# EAGLE design reg_i2c (EAGLE 7.2.0)
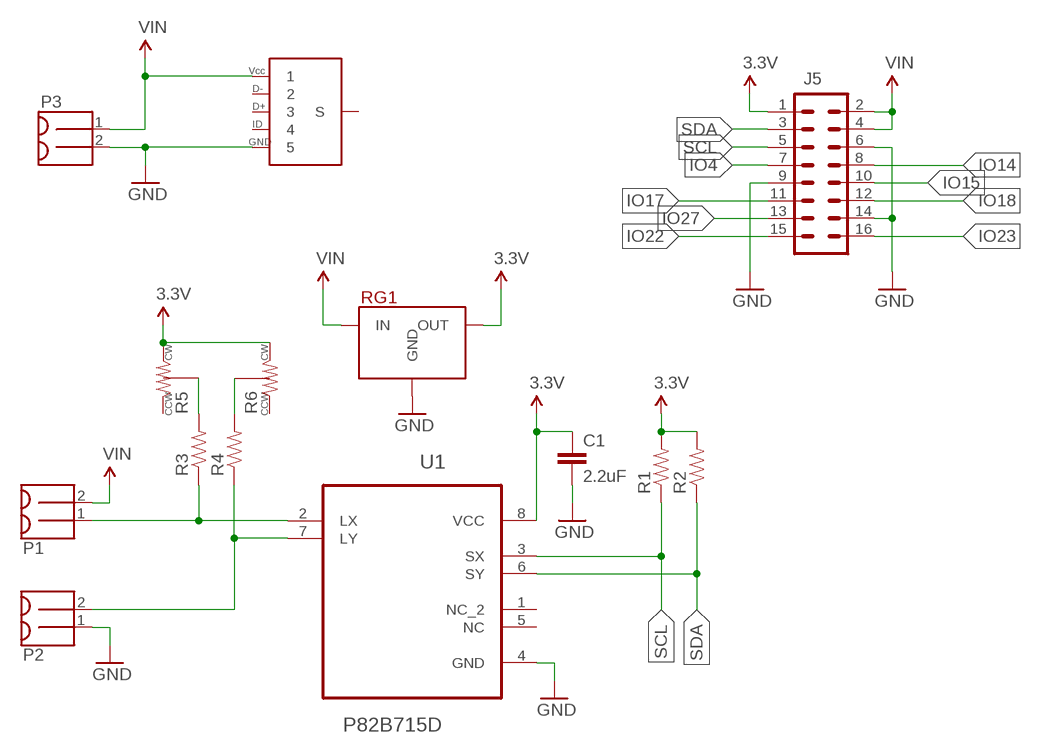
[diagram p0: schematic, sheet 1]

## Parts
C1  2.2uF  2.2UF-10V-20%(0603)  [0603-CAP]
J5  M08X2  [2X8]
P1  MOLEX_MINILITE_TRAP_2  [MOLEX_MINILITE_TRAP_2]
P2  MOLEX_MINILITE_TRAP_2  [MOLEX_MINILITE_TRAP_2]
P3  MOLEX_MINILITE_TRAP_2  [MOLEX_MINILITE_TRAP_2]
R1  RESISTOR0805-RES  [0805]
R2  RESISTOR0805-RES  [0805]
R3  RESISTOR0805-RES  [0805]
R4  RESISTOR0805-RES  [0805]
R5  POT_3MM  [POT_3MM]
R6  POT_3MM  [POT_3MM]
RG1  MURATA_REG  [MURATA_REG_HOR]
U1  P82B715D  [SOIC127P600X175-8N]
U$1  USB_MICRO  [USB_MICROB_MOLEX]

## Nets
3.3V: C1.1 J5.1 R1.2 R2.2 R5.3 R6.3 RG1.3(OUT) U1.8(VCC)
GND: C1.2 J5.6 J5.9 J5.14 P2.1 P3.2 RG1.2(GND) U1.4(GND) U$1.5
IO4: J5.7
IO14: J5.8
IO15: J5.10
IO17: J5.11
IO18: J5.12
IO22: J5.15
IO23: J5.16
IO27: J5.13
N$3: R4.2 R6.2
N$4: R3.2 R5.2
N$6: P2.2 R4.1 U1.7(LY)
N$7: P1.1 R3.1 U1.2(LX)
SCL: J5.5 R1.1 U1.3(SX)
SDA: J5.3 R2.1 U1.6(SY)
VIN: J5.2 J5.4 P1.2 P3.1 RG1.1(IN) U$1.1
Unconnected: R5.1 R6.1 U1.1(NC_2) U1.5(NC) U$1.2 U$1.3 U$1.4 U$1.S1(S) U$1.S2(S) U$1.S3(S) U$1.S4(S) U$1.S5(S) U$1.S6(S)

## Library data of the parts
C1 = SparkFun-Capacitors:2.2UF-10V-20%(0603): CAP-07888; PROD_ID: CAP-07888
J5 = SparkFun-Connectors:M08X2: .1" headers, two rows of 8 each
P1-P3 = Puffin:MOLEX_MINILITE_TRAP_2
R1-R4 = SparkFun-Resistors:RESISTOR: Resistor Basic schematic elements and footprints for 0603, 1206, and PTH resistors.
R5 R6 = Puffin:POT_3MM
RG1 = Puffin:MURATA_REG
U1 = Texas Instruments_By_element14_Batch_1:P82B715D: I2C BUS EXTENDER; MPN: P82B715D; OC_FARNELL: 1604945; OC_NEWARK: 84M9793; PACKAGE: SOIC-8; SUPPLIER: Texas Instruments
U$1 = Puffin:USB_MICRO

## Board
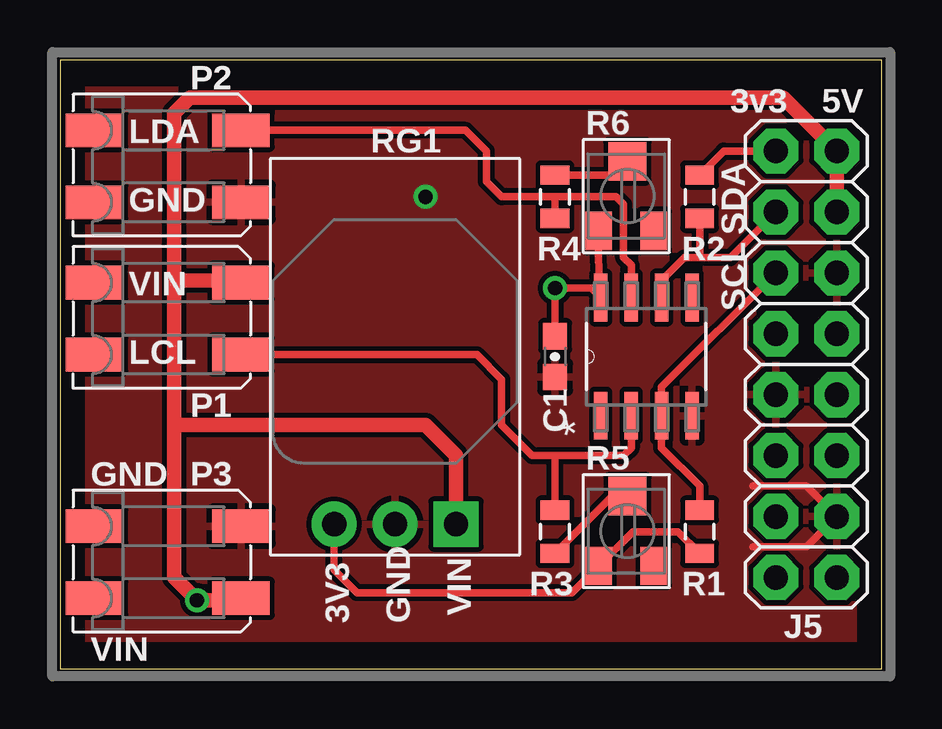
[diagram p1: board, top side]
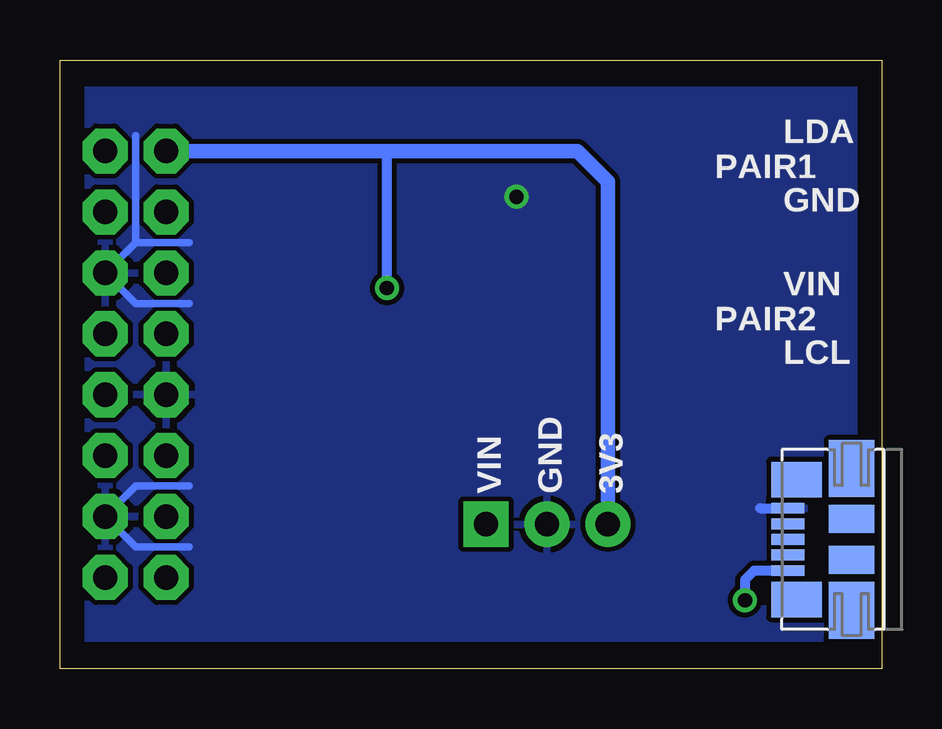
[diagram p2: board, bottom side, seen from below]

Size 34.27 x 25.39 mm. Coordinates in mm from the lower left corner, seen from the top.
Outline: 0,0 34.27,0 34.27,25.39 0,25.39 0,0
Copper layers (1*16): Top 0.035mm / dielectric 1.5mm / Bottom 0.035mm
Design rules "default": minimum track width 10mil, minimum drill 24mil, track to track 8mil, track to pad 8mil, pad to pad 8mil, via to via 8mil, smd to smd 8mil, copper to edge 40mil, drill to drill 8mil, minimum pad ring 10mil, minimum via ring 8mil, stop-mask expansion 4mil, vias tented up to drill 0mil, thermal gap 10mil

### Footprints (pad centres in the part's own frame; a part is rotated, then mirrored left to right if it is on the bottom)
0603-CAP = smd 1.1 x 1: 1 -0.85,0; 2 0.85,0
2X8 = drill 1.016 pad 1.88 octagon: 1 0,0; 2 0,2.54; 3 2.54,0; 4 2.54,2.54; 5 5.08,0; 6 5.08,2.54; 7 7.62,0; 8 7.62,2.54; 9 10.16,0; 10 10.16,2.54; 11 12.7,0; 12 12.7,2.54; 13 15.24,0; 14 15.24,2.54; 15 17.78,0; 16 17.78,2.54
MOLEX_MINILITE_TRAP_2 = smd 2.4 x 1.4: 1 -3.1,1.5; 2 -3.1,-1.5; 3 3,1.5; 4 3,-1.5
0805 = smd 0.8 x 1.2: 1 -0.9,0; 2 0.9,0
POT_3MM = smd 1.1 x 1.6: 1 2.85,0.8; 3 0.55,0.8 | smd 1.6 x 1.6: 2 1.75,3.7
MURATA_REG_HOR = drill 1.016 pad 1.88 square: 1 2.54,0 | drill 1.016 pad 1.88: 2 0,0; 3 -2.54,0
SOIC127P600X175-8N = smd 1.981 x 0.559: 1 -2.464,1.905; 2 -2.464,0.635; 3 -2.464,-0.635; 4 -2.464,-1.905; 5 2.464,-1.905; 6 2.464,-0.635; 7 2.464,0.635; 8 2.464,1.905
USB_MICROB_MOLEX = smd 1.38 x 0.45: 1 2.65,1.3; 2 2.65,0.65; 3 2.65,0; 4 2.65,-0.65; 5 2.65,-1.3 | smd 2.1 x 1.48: S1 2.3,-2.5; S2 2.3,2.5 | smd 1.9 x 2.375: S3 0,2.95; S4 0,-2.95 | smd 1.9 x 1.175: S5 0,0.85; S6 0,-0.85

### Placement (x,y rotation side)
C1  20.64,13.02 270 top
J5  29.84,21.59 270 top
P1  4.45,14.61 180 top
P2  4.45,20.95 180 top
P3  4.45,4.45 180 top
R1  26.67,5.71 270 top
R2  26.67,19.68 90 top
R3  20.64,5.71 270 top
R4  20.64,19.68 90 top
R5  21.91,3.49 0 top
R6  21.91,17.46 0 top
RG1  13.97,6.03 0 top
U1  24.45,13.02 90 top
U$1  1.27,5.4 180 bottom

### Tracks (layer width: path | path; a pad name or v marks a point on that pad's centre or on a via)
3.3V  (via drill 0.6)
  Top 0.305: C1.1 v20.64,15.88 22.15,15.88 U1.8 22.47,15.56 R6.3 | R1.2 25.77,5.71 23.88,5.71 R5.3 21.34,3.17 12.38,3.17 11.43,4.13 RG1.3 | R2.2 27.68,21.59 J5.1
  Bottom 0.406: v20.64,15.88 20.64,21.59
  Bottom 0.61: J5.1 20.64,21.59 12.7,21.59 11.43,20.32 RG1.3
GND  (via drill 0.6)
  Top 0.305: 28.89,7.62 31.11,7.62 J5.14 31.11,5.08 28.89,5.08
  Bottom 0.305: 31.11,17.78 J5.6 31.11,15.24 28.89,15.24 | 31.11,17.78 28.89,17.78 | 28.89,7.62 31.11,7.62 J5.14 31.11,5.08 28.89,5.08 | 31.11,17.78 31.11,22.23
  Bottom 0.406: 5.08,6.69 4.32,6.69
  other vias: 15.24,19.68
  pour Top: -1.27,24.13 36.83,24.13 36.83,1.27 -1.27,1.27
  pour Bottom: -1.27,24.13 35.56,24.13 35.56,1.27 -1.27,1.27
N$3
  Top 0.305: R4.2 23.08,20.59 R6.2
N$4
  Top 0.305: R3.2 23.02,7.19 R5.2
N$6
  Top 0.305: U1.7 23.81,16.83 23.5,17.14 23.5,19.37 23.18,19.68 20.64,19.68 | R4.1 20.64,19.68 | 20.64,19.68 18.41,19.68 17.78,20.32 17.78,21.59 16.91,22.45 P2.2
N$7
  Top 0.305: U1.2 23.81,9.21 23.5,8.89 20.64,8.89 | 20.64,8.89 19.68,8.89 18.41,10.16 18.41,12.06 17.38,13.11 P1.1 | R3.1 20.64,8.89
SCL
  Top 0.305: R1.1 26.67,7.62 25.08,9.21 U1.3 25.08,11.75 J5.5
SDA
  Top 0.305: J5.3 27.94,17.14 26.67,17.14 | 26.67,17.14 26.04,17.14 25.08,16.19 U1.6 | R2.1 26.67,17.14
VIN  (via drill 0.6)
  Top 0.508: 7.46,2.86 P3.1
  Top 0.61: 4.76,10.16 4.76,3.81 v5.71,2.86 7.46,2.86 | J5.4 J5.2 30.16,23.81 5.4,23.81 4.76,23.18 4.76,16.19 | RG1.1 16.51,8.89 15.24,10.16 4.76,10.16 | 4.76,16.19 4.76,10.16 | P1.2 7.46,16.19 4.76,16.19
  Bottom 0.406: v5.71,2.86 5.71,3.71 5.33,4.1 U$1.1

### Text on the board
tPlace: 3v3 | 5V | LDA | GND | SDA | VIN | SCL | LCL | GND | 3V3 | GND | VIN | VIN
bPlace: LDA | PAIR1 | GND | VIN | PAIR2 | LCL | 3V3 | GND | VIN